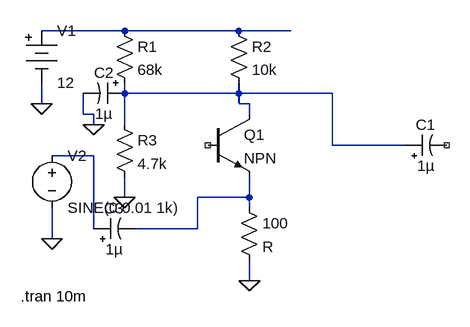
[diagram p0: schematic eca04 exp6.asc]
eca04 exp6.asc, the LTspice schematic file:
Version 4.1
SHEET 1 880 680
WIRE 160 96 32 96
WIRE 336 96 160 96
WIRE 416 96 336 96
WIRE 160 192 160 176
WIRE 336 192 336 176
WIRE 336 192 160 192
WIRE 480 192 336 192
WIRE 32 208 32 176
WIRE 336 208 336 192
WIRE 352 208 336 208
WIRE 96 224 96 192
WIRE 112 224 96 224
WIRE 352 224 352 208
WIRE 112 240 112 224
WIRE 160 240 160 192
WIRE 480 272 480 192
WIRE 592 272 480 272
WIRE 112 288 48 288
WIRE 160 352 160 320
WIRE 352 352 352 320
WIRE 352 352 272 352
WIRE 352 368 352 352
WIRE 112 400 112 288
WIRE 272 400 272 352
WIRE 272 400 176 400
WIRE 48 416 48 368
WIRE 352 480 352 448
FLAG 32 208 0
FLAG 112 240 0
FLAG 48 416 0
FLAG 160 352 0
FLAG 352 480 0
SYMBOL Misc\\battery 32 80 R0
SYMATTR InstName V1
SYMATTR Value 12
SYMBOL res 144 80 R0
SYMATTR InstName R1
SYMATTR Value 68k
SYMBOL res 320 80 R0
SYMATTR InstName R2
SYMATTR Value 10k
SYMBOL res 144 224 R0
SYMATTR InstName R3
SYMATTR Value 4.7k
SYMBOL res 336 352 R0
SYMATTR InstName 100
SYMBOL voltage 48 272 R0
WINDOW 123 0 0 Left 0
WINDOW 39 0 0 Left 0
SYMATTR InstName V2
SYMATTR Value SINE(0 0.01 1k)
SYMBOL polcap 592 288 R270
WINDOW 0 32 32 VTop 2
WINDOW 3 0 32 VBottom 2
SYMATTR InstName C1
SYMATTR Value 1µ
SYMBOL polcap 112 416 R270
WINDOW 0 32 32 VTop 2
WINDOW 3 0 32 VBottom 2
SYMATTR InstName C3
SYMATTR Value 1µ
SYMBOL npn 288 224 R0
SYMATTR InstName Q1
SYMBOL polcap 160 176 R90
WINDOW 0 0 32 VBottom 2
WINDOW 3 32 32 VTop 2
SYMATTR InstName C2
SYMATTR Value 1µ
TEXT 0 504 Left 2 !.tran 10m

The netlist it stands for:
* eca04 exp6.asc
V1 N001 0 12
R1 N001 N002 68k
R2 N001 N002 10k
R3 N002 0 4.7k
R§100 N004 0 R
V2 N003 0 SINE(0 0.01 1k)
C1 N002 NC_01 1µ
C3 N003 N004 1µ
Q1 N002 NC_02 N004 0 NPN
C2 N002 0 1µ
.model NPN NPN
.model PNP PNP
.lib standard.bjt
.tran 10m
.backanno
.end